# EAGLE schematic deviantlcd (EAGLE 6.3)
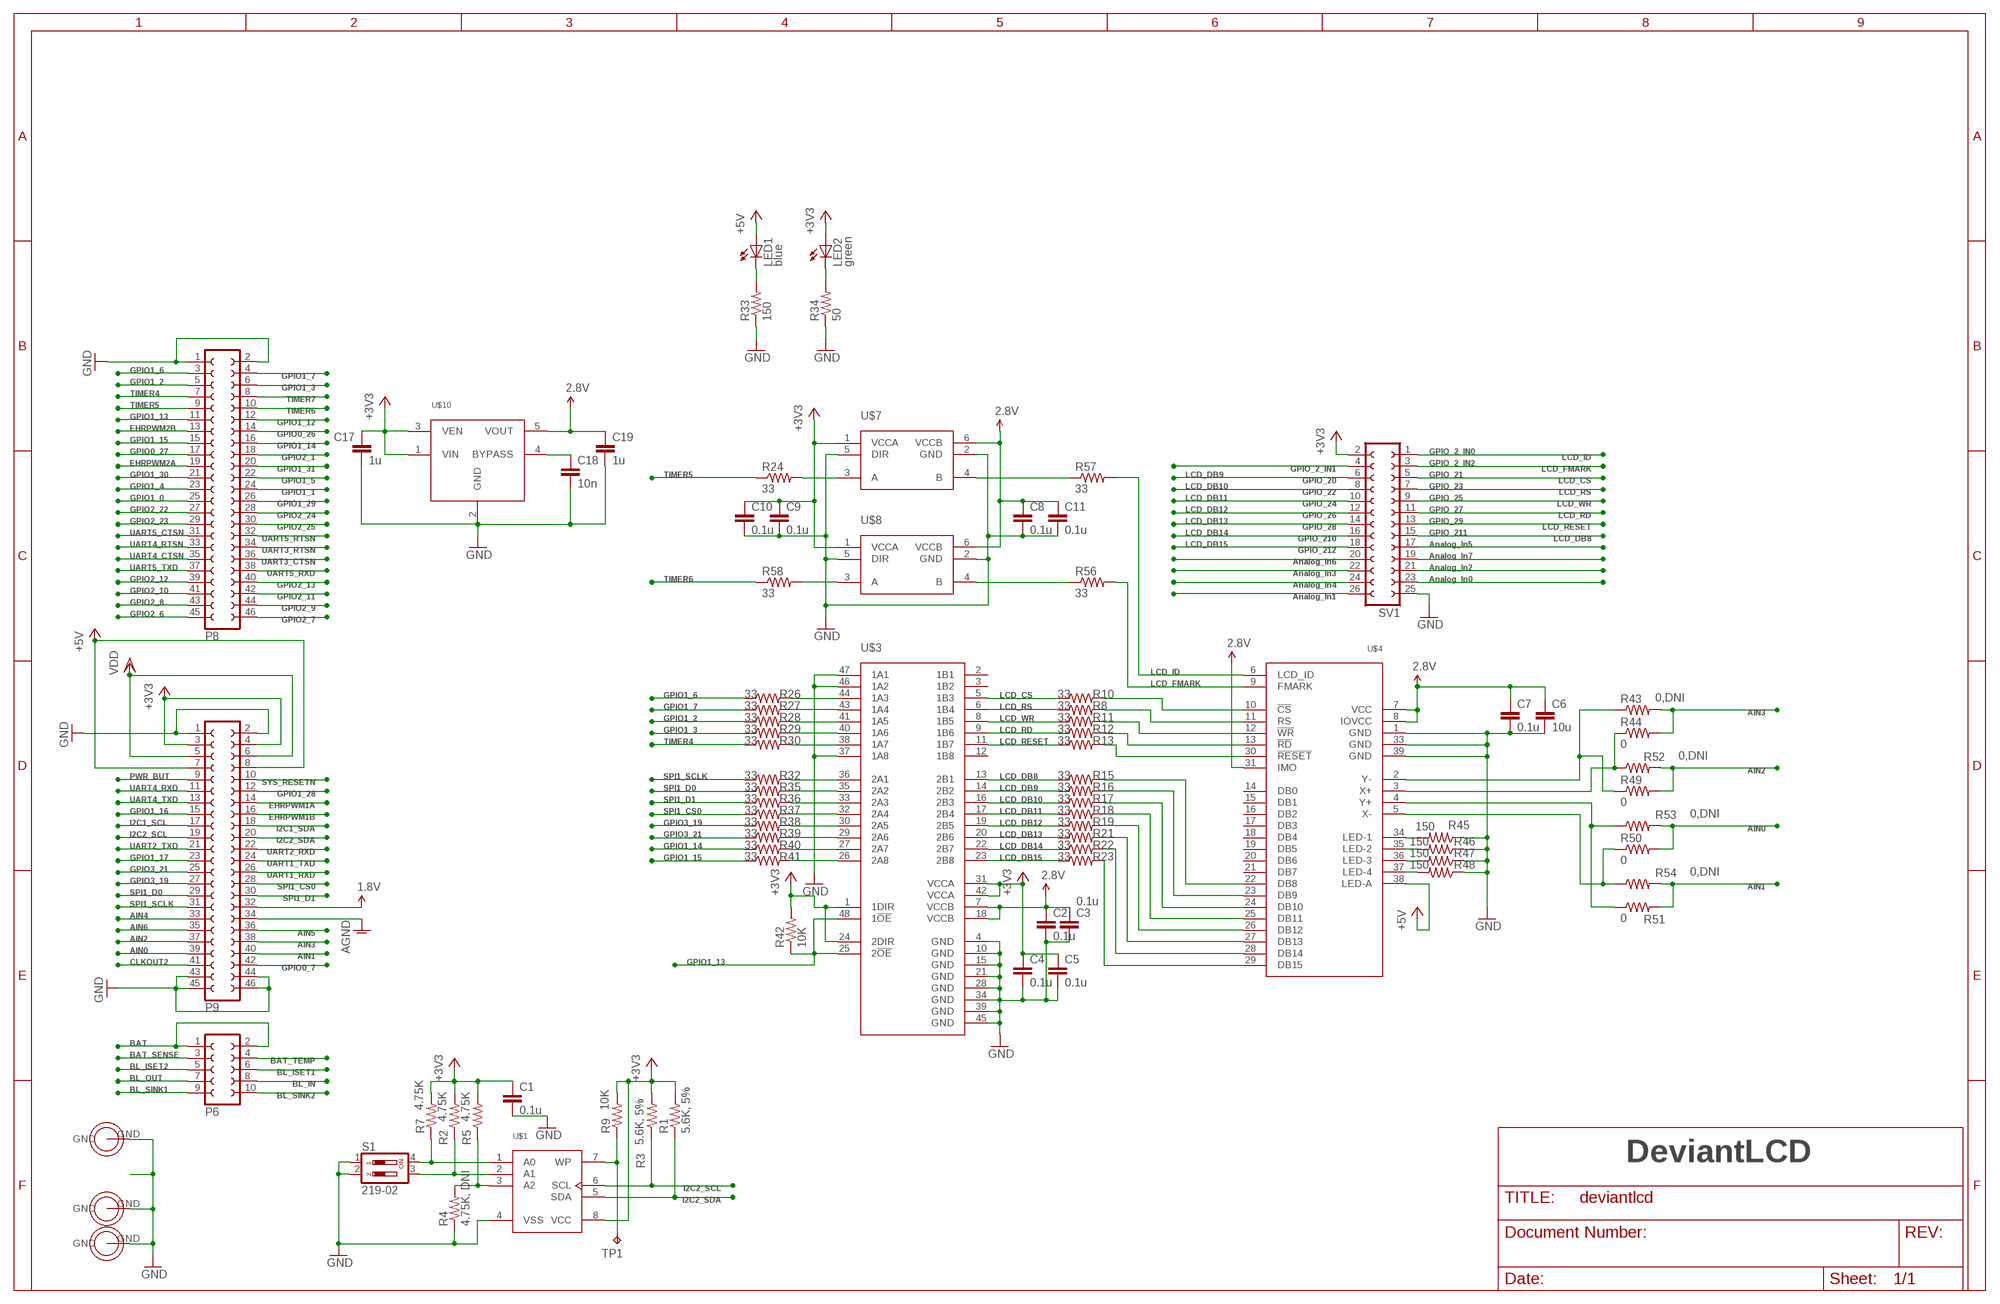
[diagram p0: schematic, sheet 1]

## Parts
C1  0.1u  C-EUC0603  [C0603]
C2  0.1u  C-EUC0603  [C0603]
C3  0.1u  C-EUC0603  [C0603]
C4  0.1u  C-EUC0603  [C0603]
C5  0.1u  C-EUC0603  [C0603]
C6  10u  C-EUC0603  [C0603]
C7  0.1u  C-EUC0603  [C0603]
C8  0.1u  C-EUC0603  [C0603]
C9  0.1u  C-EUC0603  [C0603]
C10  0.1u  C-EUC0603  [C0603]
C11  0.1u  C-EUC0603  [C0603]
C17  1u  C-EUC0603  [C0603]
C18  10n  C-EUC0603  [C0603]
C19  1u  C-EUC0603  [C0603]
H1  HOLE  [HOLE]
H3  HOLE  [HOLE]
H4  HOLE  [HOLE]
LED1  blue  LEDCHIPLED_0603  [CHIPLED_0603]
LED2  green  LEDCHIPLED_0603  [CHIPLED_0603]
P6  FE05-2  [FE05-2]
P8  FE23-2  [FE23-2]
P9  FE23-2  [FE23-2]
R1  5.6K, 5%  R-US_R0603  [R0603]
R2  4.75K  R-US_R0603  [R0603]
R3  5.6K, 5%  R-US_R0603  [R0603]
R4  4.75K, DNI  R-US_R0603  [R0603]
R5  4.75K  R-US_R0603  [R0603]
R7  4.75K  R-US_R0603  [R0603]
R8  33  R-US_R0402  [R0402]
R9  10K  R-US_R0603  [R0603]
R10  33  R-US_R0402  [R0402]
R11  33  R-US_R0402  [R0402]
R12  33  R-US_R0402  [R0402]
R13  33  R-US_R0402  [R0402]
R15  33  R-US_R0402  [R0402]
R16  33  R-US_R0402  [R0402]
R17  33  R-US_R0402  [R0402]
R18  33  R-US_R0402  [R0402]
R19  33  R-US_R0402  [R0402]
R21  33  R-US_R0402  [R0402]
R22  33  R-US_R0402  [R0402]
R23  33  R-US_R0402  [R0402]
R24  33  R-US_R0402  [R0402]
R26  33  R-US_R0402  [R0402]
R27  33  R-US_R0402  [R0402]
R28  33  R-US_R0402  [R0402]
R29  33  R-US_R0402  [R0402]
R30  33  R-US_R0402  [R0402]
R32  33  R-US_R0402  [R0402]
R33  150  R-US_R0603  [R0603]
R34  50  R-US_R0603  [R0603]
R35  33  R-US_R0402  [R0402]
R36  33  R-US_R0402  [R0402]
R37  33  R-US_R0402  [R0402]
R38  33  R-US_R0402  [R0402]
R39  33  R-US_R0402  [R0402]
R40  33  R-US_R0402  [R0402]
R41  33  R-US_R0402  [R0402]
R42  10K  R-US_R0402  [R0402]
R43  0,DNI  R-US_R0402  [R0402]
R44  0  R-US_R0402  [R0402]
R45  150  R-US_R0603  [R0603]
R46  150  R-US_R0603  [R0603]
R47  150  R-US_R0603  [R0603]
R48  150  R-US_R0603  [R0603]
R49  0  R-US_R0402  [R0402]
R50  0  R-US_R0402  [R0402]
R51  0  R-US_R0402  [R0402]
R52  0,DNI  R-US_R0402  [R0402]
R53  0,DNI  R-US_R0402  [R0402]
R54  0,DNI  R-US_R0402  [R0402]
R56  33  R-US_R0402  [R0402]
R57  33  R-US_R0402  [R0402]
R58  33  R-US_R0402  [R0402]
S1  219-02  [CTS-219-02]
SV1  FE13-2  [FE13-2]
TP1  TPB2,54  [B2,54]
U$1  CAT24C256  [SOIC8]
U$3  SN74LVCH16T245  [TSSOP48]
U$4  NHD-2.4-240320SF-CTXI  [NHD-2.4-240320SF-CTXI]
U$7  SN74LVC1T45  [SOT23-6]
U$8  SN74LVC1T45  [SOT23-6]
U$10  LP3985  [SOT23-5]

## Nets
1.8V: P9.32
2.85V [pwr]: C6.1 C7.1 C8.1 C11.1 C19.1 U$4.7(VCC) U$4.8(IOVCC) U$4.31(IMO) U$7.6(VCCB) U$8.6(VCCB) U$10.5(VOUT) ; supply symbol labelled 2.8V
+3V3 [pwr]: C1.1 C4.1 C5.1 C9.1 C10.1 C17.1 LED2.A P9.3 P9.4 R1.2 R2.2 R3.2 R5.2 R7.2 R9.2 R42.2 SV1.2 U$1.8(VCC) U$3.1(1DIR) U$3.24(2DIR) U$3.31(VCCA) U$3.42(VCCA) U$7.1(VCCA) U$8.1(VCCA) U$10.1(VIN) U$10.3(VEN)
+5V [pwr]: LED1.A P9.7 P9.8 U$4.38(LED-A)
AGND: P9.34
AIN0: P9.39 R50.2 R53.2
AIN1: P9.40 R51.2 R54.2
AIN2: P9.37 R49.2 R52.2
AIN3: P9.38 R43.2 R44.2
AIN4: P9.33
AIN5: P9.36
AIN6: P9.35
BAT: P6.1 P6.2
BAT_SENSE: P6.3
BAT_TEMP: P6.4
BL_IN: P6.8
BL_ISET1: P6.6
BL_ISET2: P6.5
BL_OUT: P6.7
BL_SINK1: P6.9
BL_SINK2: P6.10
CLKOUT2: P9.41
EHRPWM1A: P9.14
EHRPWM1B: P9.16
EHRPWM2A: P8.19
EHRPWM2B: P8.13
FF: SV1.4
GND [pwr]: C1.2 C2.2 C3.2 C4.2 C5.2 C6.2 C7.2 C8.2 C9.2 C10.2 C11.2 C17.2 C18.2 C19.2 H1.GND H3.GND H4.GND P8.1 P8.2 P9.1 P9.2 P9.43 P9.44 P9.45 P9.46 R4.1 R33.1 R34.1 R45.1 R46.1 R47.1 R48.1 S1.1 S1.2 SV1.25 U$1.4(VSS) U$3.4(GND) U$3.10(GND) U$3.15(GND) U$3.21(GND) U$3.28(GND) U$3.34(GND) U$3.37(1A8) U$3.39(GND) U$3.45(GND) U$3.46(1A2) U$3.47(1A1) U$4.1(GND) U$4.33(GND) U$4.39(GND) U$7.2(GND) U$7.5(DIR) U$8.2(GND) U$8.5(DIR) U$10.2(GND)
GPIO0_7: P9.42
GPIO0_26: P8.14
GPIO0_27: P8.17
GPIO1_0: P8.25
GPIO1_1: P8.24
GPIO1_2: P8.5 R28.1
GPIO1_3: P8.6 R29.1
GPIO1_4: P8.23
GPIO1_5: P8.22
GPIO1_6: P8.3 R26.1
GPIO1_7: P8.4 R27.1
GPIO1_12: P8.12
GPIO1_13: P8.11 R42.1 U$3.25(2!OE) U$3.48(1!OE)
GPIO1_14: P8.16 R40.1
GPIO1_15: P8.15 R41.1
GPIO1_16: P9.15
GPIO1_17: P9.23
GPIO1_28: P9.12
GPIO1_29: P8.26
GPIO1_30: P8.21
GPIO1_31: P8.20
GPIO2_1: P8.18
GPIO2_6: P8.45
GPIO2_7: P8.46
GPIO2_8: P8.43
GPIO2_9: P8.44
GPIO2_10: P8.41
GPIO2_11: P8.42
GPIO2_12: P8.39
GPIO2_13: P8.40
GPIO2_22: P8.27
GPIO2_23: P8.29
GPIO2_24: P8.28
GPIO2_25: P8.30
GPIO3_19: P9.27 R38.1
GPIO3_21: P9.25 R39.1
I2C1_SCL: P9.17
I2C1_SDA: P9.18
I2C2_SCL: P9.19 R3.1 U$1.6(SCL)
I2C2_SDA: P9.20 R1.1 U$1.5(SDA)
LCD_CS: R10.1 SV1.5 U$3.5(1B3)
LCD_DB8: R15.1 SV1.15 U$3.13(2B1)
LCD_DB9: R16.1 SV1.6 U$3.14(2B2)
LCD_DB10: R17.1 SV1.8 U$3.16(2B3)
LCD_DB11: R18.1 SV1.10 U$3.17(2B4)
LCD_DB12: R19.1 SV1.12 U$3.19(2B5)
LCD_DB13: R21.1 SV1.14 U$3.20(2B6)
LCD_DB14: R22.1 SV1.16 U$3.22(2B7)
LCD_DB15: R23.1 SV1.18 U$3.23(2B8)
LCD_FMARK: R56.2 SV1.3 U$4.9(FMARK)
LCD_ID: R57.2 SV1.1 U$4.6(LCD_ID)
LCD_RD: R12.1 SV1.11 U$3.9(1B6)
LCD_RESET: R13.1 SV1.13 U$3.11(1B7)
LCD_RS: R8.1 SV1.7 U$3.6(1B4)
LCD_WR: R11.1 SV1.9 U$3.8(1B5)
N$1: R7.1 S1.4 U$1.1(A0)
N$2: R2.1 S1.3 U$1.2(A1)
N$3: R4.2 R5.1 U$1.3(A2)
N$5: R9.1 TP1.TP U$1.7(WP)
N$14: SV1.20
N$15: SV1.22
N$16: SV1.24
N$17: SV1.26
N$25: SV1.17
N$26: SV1.19
N$27: SV1.21
N$28: SV1.23
N$29: LED1.C R33.2
N$30: LED2.C R34.2
N$31: R24.2 U$7.3(A)
N$32: R58.2 U$8.3(A)
N$33: R26.2 U$3.44(1A3)
N$34: R27.2 U$3.43(1A4)
N$35: R28.2 U$3.41(1A5)
N$36: R29.2 U$3.40(1A6)
N$37: R30.2 U$3.38(1A7)
N$39: R32.2 U$3.36(2A1)
N$40: R35.2 U$3.35(2A2)
N$41: R36.2 U$3.33(2A3)
N$42: R37.2 U$3.32(2A4)
N$43: R38.2 U$3.30(2A5)
N$44: R39.2 U$3.29(2A6)
N$45: R40.2 U$3.27(2A7)
N$46: R41.2 U$3.26(2A8)
N$47: R57.1 U$7.4(B)
N$48: R56.1 U$8.4(B)
N$81: R10.2 U$4.10(!CS)
N$82: R8.2 U$4.11(RS)
N$83: R11.2 U$4.12(!WR)
N$84: R12.2 U$4.13(!RD)
N$85: R13.2 U$4.30(!RESET)
N$87: R23.2 U$4.29(DB15)
N$88: R22.2 U$4.28(DB14)
N$89: R21.2 U$4.27(DB13)
N$90: R19.2 U$4.26(DB12)
N$91: R18.2 U$4.25(DB11)
N$92: R17.2 U$4.24(DB10)
N$93: R16.2 U$4.23(DB9)
N$94: R15.2 U$4.22(DB8)
N$97: C18.1 U$10.4(BYPASS)
N$99: R45.2 U$4.34(LED-1)
N$100: R46.2 U$4.35(LED-2)
N$101: R47.2 U$4.36(LED-3)
N$102: R48.2 U$4.37(LED-4)
N$103: R43.1 R49.1 U$4.2(Y-)
N$104: R44.1 R52.1 U$4.3(X+)
N$105: R51.1 R53.1 U$4.4(Y+)
N$106: R50.1 R54.1 U$4.5(X-)
PWR_BUT: P9.9
SPI1_CS0: P9.28 R37.1
SPI1_D0: P9.29 R35.1
SPI1_D1: P9.30 R36.1
SPI1_SCLK: P9.31 R32.1
SYS_RESETN: P9.10
TIMER4: P8.7 R30.1
TIMER5: P8.9 R24.1
TIMER6: P8.10 R58.1
TIMER7: P8.8
UART1_RXD: P9.26
UART1_TXD: P9.24
UART2_RXD: P9.22
UART2_TXD: P9.21
UART3_CTSN: P8.36
UART3_RTSN: P8.34
UART4_CTSN: P8.35
UART4_RTSN: P8.33
UART4_RXD: P9.11
UART4_TXD: P9.13
UART5_CTSN: P8.31
UART5_RTSN: P8.32
UART5_RXD: P8.38
UART5_TXD: P8.37
VCCB@2: C2.1 C3.1 U$3.7(VCCB) U$3.18(VCCB) ; supply symbol labelled 2.8V
VDD: P9.5 P9.6
Unconnected: U$3.2(1B1) U$3.3(1B2) U$3.12(1B8) U$4.14(DB0) U$4.15(DB1) U$4.16(DB2) U$4.17(DB3) U$4.18(DB4) U$4.19(DB5) U$4.20(DB6) U$4.21(DB7)

## Notes on the sheet
- GPIO_2_IN0
- GPIO_2_IN1 | GPIO_2_IN2
- GPIO_20 | GPIO_21
- GPIO_22 | GPIO_23
- GPIO_24 | GPIO_25
- GPIO_26 | GPIO_27
- GPIO_28 | GPIO_29
- GPIO_210 | GPIO_211
- GPIO_212 | Analog_In5
- Analog_In6 | Analog_In7
- Analog_In3 | Analog_In2
- Analog_In4 | Analog_In0
- Analog_In1
- DeviantLCD

## Library data of the parts
C1-C5 C7-C11 = rcl:C-EU: CAPACITOR, European symbol; MPN: VJ0603V104ZXXCW1BC
C6 = rcl:C-EU: CAPACITOR, European symbol; MPN: LMK107BBJ106MALT
C17 C19 = rcl:C-EU: CAPACITOR, European symbol; MPN: C1608X7R1C105K
C18 = rcl:C-EU: CAPACITOR, European symbol; MPN: VJ0603Y103KXACW1BC
H1 H3 H4 = BoneCapeParts:HOLE
LED1 = led:LED: LED OSRAM: - CHIPLED LG R971, LG N971, LY N971, LG Q971, LY Q971, LO R971, LY R971 LH N974, LH R974 LS Q976, LO Q976, LY Q976 LO Q996 - Hyper CHIPLED LW Q18S LB Q993, LB Q99A, LB R99A - SideLED LS A670, LO A670, LY A670, LG A670, LP A670 LB A673, LV A673, LT A673, LW A673 LH A674 LY A675 LS A676, LA A676, LO A676, LY A676, LW A676 LS A679, LY A679, LG A679 - Hyper Micro SIDELED® LS Y876, LA Y876, LO Y876, LY Y876 LT Y87S - SmartLED LW L88C, LW L88S LB L89C, LB L89S, LG L890 LS L89K, LO L89K, LY L89K LS L896, LA L896, LO L896, LY L896 - TOPLED LS T670, LO T670, LY T670, LG T670, LP T670 LSG T670, LSP T670, LSY T670, LOP T670, LYG T670 LG T671, LOG T671, LSG T671 LB T673, LV T673, LT T673, LW T673 LH T674 LS T676, LA T676, LO T676, LY T676, LB T676, LH T676, LSB T676, LW T676 LB T67C, LV T67C, LT T67C, LS T67K, LO T67K, LY T67K, LW E67C LS E67B, LA E67B, LO E67B, LY E67B, LB E67C, LV E67C, LT E67C LW T67C LS T679, LY T679, LG T679 LS T770, LO T770, LY T770, LG T770, LP T770 LB T773, LV T773, LT T773, LW T773 LH T774 LS E675, LA E675, LY E675, LS T675 LS T776, LA T776, LO T776, LY T776, LB T776 LHGB T686 LT T68C, LB T68C - Hyper Mini TOPLED® LB M676 - Mini TOPLED Santana® LG M470 LS M47K, LO M47K, LY M47K Source: http://www.osram.convergy.de LUXEON: - LUMILED® LXK2-PW12-R00, LXK2-PW12-S00, LXK2-PW14-U00, LXK2-PW14-V00 LXK2-PM12-R00, LXK2-PM12-S00, LXK2-PM14-U00 LXK2-PE12-Q00, LXK2-PE12-R00, LXK2-PE12-S00, LXK2-PE14-T00, LXK2-PE14-U00 LXK2-PB12-K00, LXK2-PB12-L00, LXK2-PB12-M00, LXK2-PB14-N00, LXK2-PB14-P00, LXK2-PB14-Q00 LXK2-PR12-L00, LXK2-PR12-M00, LXK2-PR14-Q00, LXK2-PR14-R00 LXK2-PD12-Q00, LXK2-PD12-R00, LXK2-PD12-S00 LXK2-PH12-R00, LXK2-PH12-S00 LXK2-PL12-P00, LXK2-PL12-Q00, LXK2-PL12-R00 Source: www.luxeon.com KINGBRIGHT: KA-3528ASYC Source: www.kingbright.com; MPN: HT-193NB-5589
LED2 = led:LED: LED OSRAM: - CHIPLED LG R971, LG N971, LY N971, LG Q971, LY Q971, LO R971, LY R971 LH N974, LH R974 LS Q976, LO Q976, LY Q976 LO Q996 - Hyper CHIPLED LW Q18S LB Q993, LB Q99A, LB R99A - SideLED LS A670, LO A670, LY A670, LG A670, LP A670 LB A673, LV A673, LT A673, LW A673 LH A674 LY A675 LS A676, LA A676, LO A676, LY A676, LW A676 LS A679, LY A679, LG A679 - Hyper Micro SIDELED® LS Y876, LA Y876, LO Y876, LY Y876 LT Y87S - SmartLED LW L88C, LW L88S LB L89C, LB L89S, LG L890 LS L89K, LO L89K, LY L89K LS L896, LA L896, LO L896, LY L896 - TOPLED LS T670, LO T670, LY T670, LG T670, LP T670 LSG T670, LSP T670, LSY T670, LOP T670, LYG T670 LG T671, LOG T671, LSG T671 LB T673, LV T673, LT T673, LW T673 LH T674 LS T676, LA T676, LO T676, LY T676, LB T676, LH T676, LSB T676, LW T676 LB T67C, LV T67C, LT T67C, LS T67K, LO T67K, LY T67K, LW E67C LS E67B, LA E67B, LO E67B, LY E67B, LB E67C, LV E67C, LT E67C LW T67C LS T679, LY T679, LG T679 LS T770, LO T770, LY T770, LG T770, LP T770 LB T773, LV T773, LT T773, LW T773 LH T774 LS E675, LA E675, LY E675, LS T675 LS T776, LA T776, LO T776, LY T776, LB T776 LHGB T686 LT T68C, LB T68C - Hyper Mini TOPLED® LB M676 - Mini TOPLED Santana® LG M470 LS M47K, LO M47K, LY M47K Source: http://www.osram.convergy.de LUXEON: - LUMILED® LXK2-PW12-R00, LXK2-PW12-S00, LXK2-PW14-U00, LXK2-PW14-V00 LXK2-PM12-R00, LXK2-PM12-S00, LXK2-PM14-U00 LXK2-PE12-Q00, LXK2-PE12-R00, LXK2-PE12-S00, LXK2-PE14-T00, LXK2-PE14-U00 LXK2-PB12-K00, LXK2-PB12-L00, LXK2-PB12-M00, LXK2-PB14-N00, LXK2-PB14-P00, LXK2-PB14-Q00 LXK2-PR12-L00, LXK2-PR12-M00, LXK2-PR14-Q00, LXK2-PR14-R00 LXK2-PD12-Q00, LXK2-PD12-R00, LXK2-PD12-S00 LXK2-PH12-R00, LXK2-PH12-S00 LXK2-PL12-P00, LXK2-PL12-Q00, LXK2-PL12-R00 Source: www.luxeon.com KINGBRIGHT: KA-3528ASYC Source: www.kingbright.com; MPN: LG Q971-KN-1
P6 = con-lsta:FE05-2: FEMALE HEADER; MPN: TSHC-105-D-03-255-GT-LF; OC_FARNELL: unknown; OC_NEWARK: unknown
P8 P9 = BoneCapeParts:FE23-2: FEMALE HEADER; MPN: TSHC-123-D-03-255-GT-LF; OC_FARNELL: unknown; OC_NEWARK: unknown
R1 R3 = rcl:R-US_: RESISTOR, American symbol; MPN: RK73B1JTTDD562J
R2 R4 R5 R7 = rcl:R-US_: RESISTOR, American symbol; MPN: CR0603-FX-4751GLF
R8 R10-R13 R15-R19 R21-R24 R26 R27 R29 R30 R32 R35-R41 R56-R58 = rcl:R-US_: RESISTOR, American symbol; MPN: CR0402-JW-330GLF
R9 R42 = rcl:R-US_: RESISTOR, American symbol; MPN: WR06X1002FTL
R28 = rcl:R-US_: RESISTOR, American symbol
R33 R45-R48 = rcl:R-US_: RESISTOR, American symbol; MPN: 302-150-RC
R34 = rcl:R-US_: RESISTOR, American symbol; MPN: 302-49.9-RC
R43 R44 R49-R54 = rcl:R-US_: RESISTOR, American symbol; MPN: ERJ-2GE0R00X
S1 = switch-dil:219-02*: Surface Mount DIP Switch Series 219 SMT CTS Electronic Components Sourc: www.ctscorp.com; MPN: 219-2MST; OC_FARNELL: unknown; OC_NEWARK: unknown
SV1 = BoneCapeParts:FE13-2: FEMALE HEADER; MPN: NPTC132KFMS-RC
TP1 = testpad:TP: Test pad
U$1 = BoneCapeParts:CAT24C256; MPN: CAT24C256WI-GT3
U$3 = BoneCapeParts:SN74LVCH16T245; MPN: SN74LVCH16T245DGGR
U$4 = BoneCapeParts:NHD-2.4-240320SF-CTXI; MPN: NHD-2.4-240320SF-CTXI#-T1
U$7 U$8 = BoneCapeParts:SN74LVC1T45; MPN: SN74LVC1T45DBVR
U$10 = BoneCapeParts:LP3985; MPN: LP3985IM5-2.8/NOPB

## Net classes
0 default: width 0.152 mm, drill 0.381 mm, clearance 0.152 mm
1 pwr: width 0.254 mm, drill 0.381 mm, clearance 0.152 mm